# Altium project STC12+DC.PrjPcb
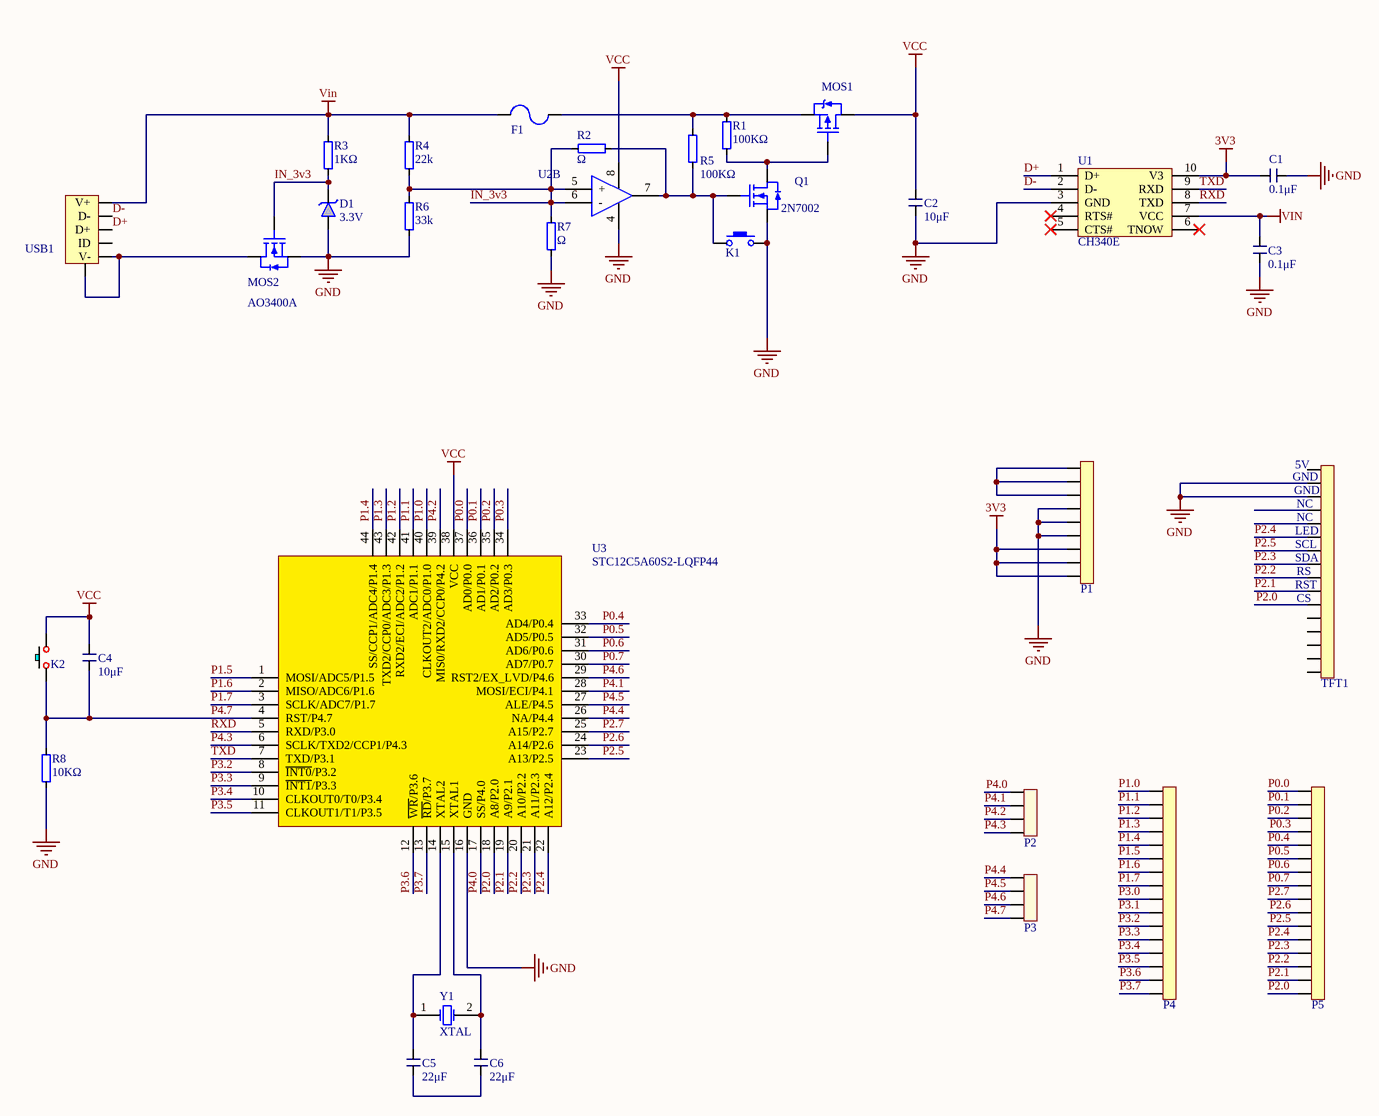
[diagram p0: 电源+STC12+ch340(1).SchDoc]
1 sheet, 32 parts. Net scope: global (net labels, ports and power ports of the same name join across sheets).

## Sheet 电源+STC12+ch340(1).SchDoc
size A3

### Parts
C1  0.1μF  [C_0603]
C2  10μF  [C_0603]
C3  0.1μF  [C_0603]
C4  10μF  [C_0805]
C5  22μF  [C_0805]
C6  22μF  [C_0805]
D1  3.3V  [DO_41_GLASS]
F1  FUSE_0805  [FB_0805]  (value not drawn)
K1  TACT SWITCH_2_SMD  [TACT SWITCH_2_SMD]  (value not drawn)
K2  micro button_2_DIP  [micro button_2_DIP]  (value not drawn)
MOS1  SI2301  [SOT_23_3]  (value not drawn)
MOS2  AO3400A  [SOT_23_3]
P1  PIN9  [PIN_9]  (value not drawn)
P2  PIN4  [PIN_4]  (value not drawn)
P3  PIN4  [PIN_4]  (value not drawn)
P4  PIN16  [PIN_16]  (value not drawn)
P5  PIN16  [PIN_16]  (value not drawn)
Q1  2N7002  [SOT_23_3]
R1  100KΩ  [R_0603]
R2  Ω  [R_0603]
R3  1KΩ  [R_0805]
R4  22k  [R_0603]
R5  100KΩ  [R_0603]
R6  33k  [R_0603]
R7  Ω  [R_0603]
R8  10KΩ  [R_0805]
TFT1  PIN16  [PIN_16]  (value not drawn)
U1  CH340E  [MSOP_10]
U2  LM2903  [TSSOP_8]  (value not drawn)  (part B of 2)
U3  STC12C5A60S2-LQFP44  [LQFP-44]
USB1  MICRO USB B  [MICRO USB B]  (value not drawn)
Y1  XTAL  [R38]

### Nets
3V3: C1.2 P1.1 P1.2 P1.3 U1.10(V3)
GND: C1.1 C2.2 C3.1 D1.1(A) K1.1 MOS2.2(S) P1.4 P1.5 P1.6 Q1.2(S) R6.1 R7.1 R8.1 TFT1.2 TFT1.3 U1.3(GND) U2.4(GND) U3.16(GND)
VCC: C2.1 C4.1 K2.2 MOS1.3(D) U2.8(VCC) U3.38(VCC)
Vin: C3.2 F1.1 R3.2 R4.2 U1.7(VCC) USB1.1(V+)
D+: U1.1(D+) USB1.3(D+)
D-: U1.2(D-) USB1.2(D-)
IN_3v3: D1.2(K) MOS2.1(G) R2.1 R3.1 R4.1 R6.2 R7.2 U2.5(+) U2.6(-)
P0.0: P5.1 U3.37(AD0/P0.0)
P0.1: P5.2 U3.36(AD1/P0.1)
P0.2: P5.3 U3.35(AD2/P0.2)
P0.3: P5.4 U3.34(AD3/P0.3)
P0.4: P5.5 U3.33(AD4/P0.4)
P0.5: P5.6 U3.32(AD5/P0.5)
P0.6: P5.7 U3.31(AD6/P0.6)
P0.7: P5.8 U3.30(AD7/P0.7)
P1.0: P4.1 U3.40(CLKOUT2/ADC0/P1.0)
P1.1: P4.2 U3.41(ADC1/P1.1)
P1.2: P4.3 U3.42(RXD2/ECI/ADC2/P1.2)
P1.3: P4.4 U3.43(TXD2/CCP0/ADC3/P1.3)
P1.4: P4.5 U3.44(SS/CCP1/ADC4/P1.4)
P1.5: P4.6 U3.1(MOSI/ADC5/P1.5)
P1.6: P4.7 U3.2(MISO/ADC6/P1.6)
P1.7: P4.8 U3.3(SCLK/ADC7/P1.7)
P2.0: P5.16 TFT1.11 U3.18(A8/P2.0)
P2.1: P5.15 TFT1.10 U3.19(A9/P2.1)
P2.2: P5.14 TFT1.9 U3.20(A10/P2.2)
P2.3: P5.13 TFT1.8 U3.21(A11/P2.3)
P2.4: P5.12 TFT1.6 U3.22(A12/P2.4)
P2.5: P5.11 TFT1.7 U3.23(A13/P2.5)
P2.6: P5.10 U3.24(A14/P2.6)
P2.7: P5.9 U3.25(A15/P2.7)
P3.0: P4.9
P3.1: P4.10
P3.2: P4.11 U3.8(~{INT0}/P3.2)
P3.3: P4.12 U3.9(~{INT1}/P3.3)
P3.4: P4.13 U3.10(CLKOUT0/T0/P3.4)
P3.5: P4.14 U3.11(CLKOUT1/T1/P3.5)
P3.6: P4.15 U3.12(~{WR}/P3.6)
P3.7: P4.16 U3.13(~{RD}/P3.7)
P4.0: P2.4 U3.17(SS/P4.0)
P4.1: P2.3 U3.28(MOSI/ECI/P4.1)
P4.2: P2.2 U3.39(MIS0/RXD2/CCP0/P4.2)
P4.3: P2.1 U3.6(SCLK/TXD2/CCP1/P4.3)
P4.4: P3.4 U3.26(NA/P4.4)
P4.5: P3.3 U3.27(ALE/P4.5)
P4.6: P3.2 U3.29(RST2/EX_LVD/P4.6)
P4.7: C4.2 K2.1 P3.1 R8.2 U3.4(RST/P4.7)
RXD: U1.8(TXD) U3.5(RXD/P3.0)
TXD: U1.9(RXD) U3.7(TXD/P3.1)
NetC5_1: C5.1 U3.14(XTAL2) Y1.1(OSC1)
NetC5_2: C5.2 C6.2
NetC6_1: C6.1 U3.15(XTAL1) Y1.2(OSC2)
NetF1_2: F1.2 MOS1.2(S) R1.2 R5.2
NetK1_2: K1.2 Q1.1(G) R2.2 R5.1 U2.7
NetMOS1_1: MOS1.1(G) Q1.3(D) R1.1
NetMOS2_3: MOS2.3(D) USB1.0(GND) USB1.5(V-)
NetP1_7: P1.7 P1.8 P1.9

Not connected (* = marked no-connect by the designer): TFT1 1 4 5 12 13 14 15 16; U1 4(RTS#)* 5(CTS#)* 6(TNOW)*; USB1 4(ID)

### Notes on the sheet
- (near TFT1) GND
- (near TFT1) 5V
- (near TFT1) NC
- (near TFT1) LED
- (near TFT1) SCL
- (near TFT1) SDA
- (near TFT1) RS
- (near TFT1) RST
- (near TFT1) CS

### Library data of the parts
C1-C3 = C_0603
C4-C6 = C_0805
D1 = 1N47XX
R1 R2 R4-R7 = R_0603
R3 R8 = R_0805
Y1 = XTAL: Crystal Oscillator; Published: 8-Jun-2000; LatestRevisionDate: 17-Jul-2002; LatestRevisionNote: Re-released for DXP Platform.; PackageReference: R38; Publisher: Altium Limited; PackageDescription: Crystal, Thru-Hole; 2 Leads; Body 3.1 x 8.2 mm (Dia.xH)